# EAGLE design BR-Master-v1.1 (EAGLE 4.13)
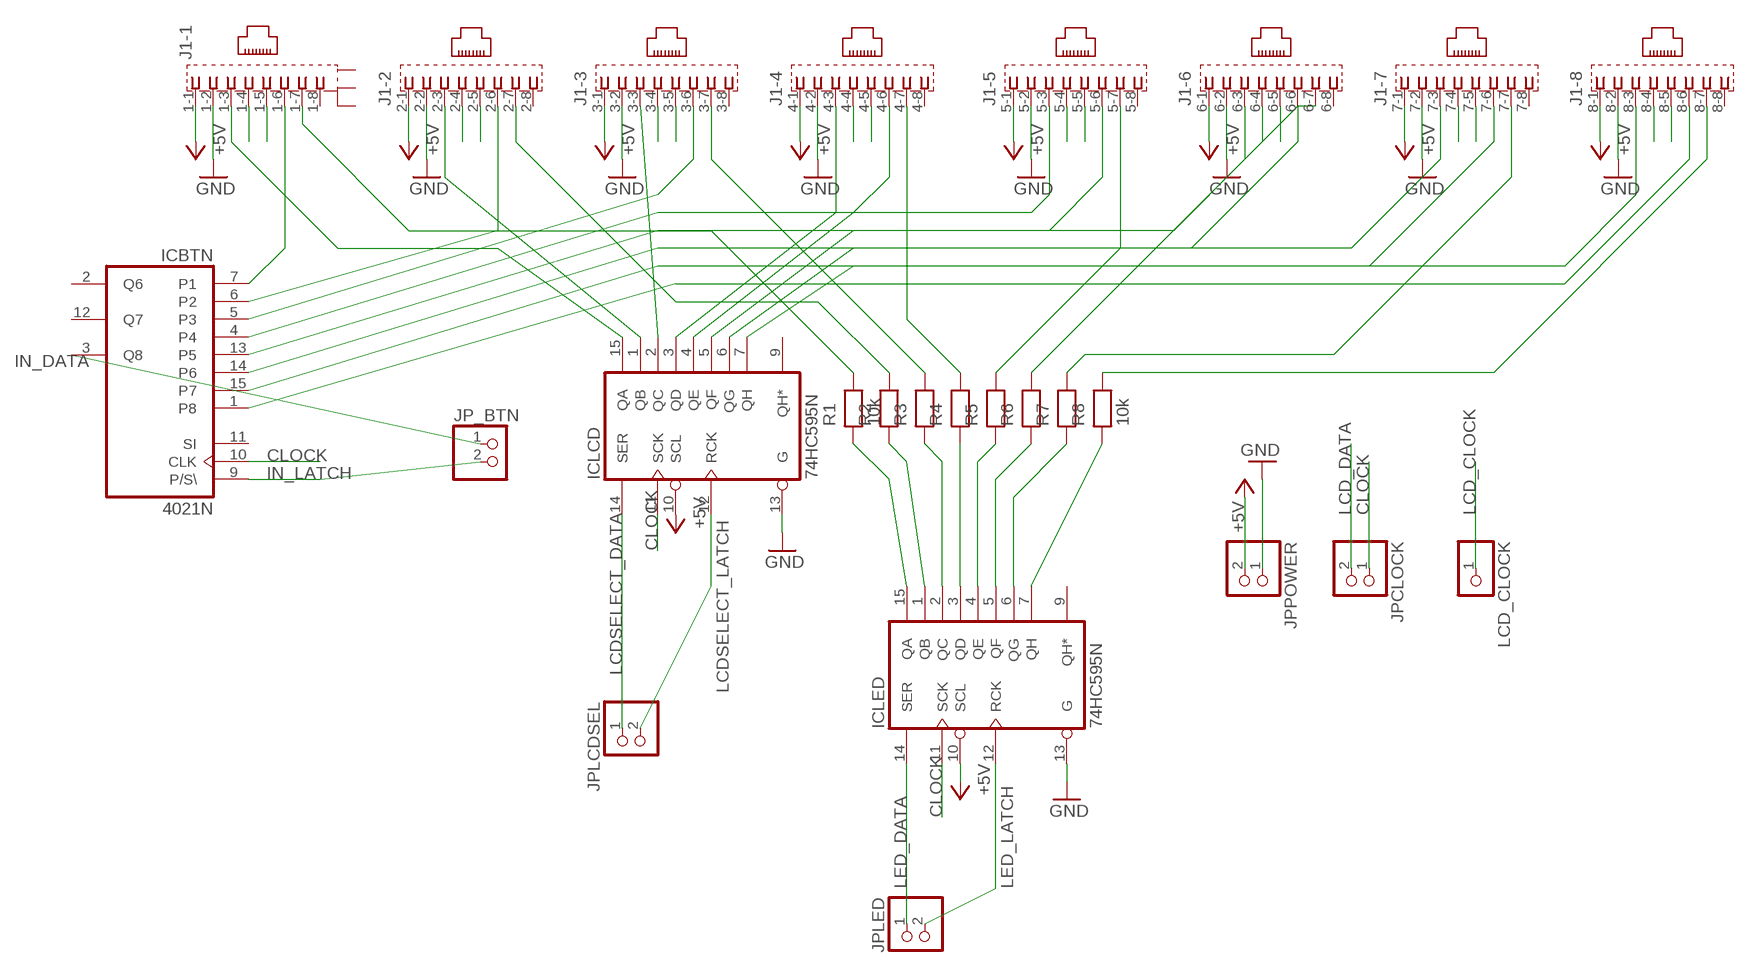
[diagram p0: schematic, sheet 1]

## Parts
ICBTN  4021N  [DIL16]
ICLCD  74HC595N  [DIL16]
ICLED  74HC595N  [DIL16]
J1  557573-1  [557573-1]
JP_BTN  PINHD-1X2  [1X02]
JPCLOCK  PINHD-1X2  [1X02]
JPLCDSEL  PINHD-1X2  [1X02]
JPLED  PINHD-1X2  [1X02]
JPPOWER  PINHD-1X2  [1X02]
LCD_CLOCK  PINHD-1X1  [1X01]
R1  10k  RESEU-12,5  [R-12,5]
R2  RESEU-12,5  [R-12,5]
R3  RESEU-12,5  [R-12,5]
R4  RESEU-12,5  [R-12,5]
R5  RESEU-12,5  [R-12,5]
R6  RESEU-12,5  [R-12,5]
R7  RESEU-12,5  [R-12,5]
R8  10k  RESEU-12,5  [R-12,5]

## Nets
BTN1: ICBTN.7(P1) J1.1-6
BTN2: ICBTN.6(P2) J1.2-6
BTN3: ICBTN.5(P3) J1.3-6
BTN4: ICBTN.4 J1.4-6
BTN5: ICBTN.13(P5) J1.5-6
BTN6: ICBTN.14(P6) J1.6-6
BTN7: ICBTN.15(P7) J1.7-6
BTN8: ICBTN.1(P8) J1.8-6
CLOCK: ICBTN.10(CLK) ICLCD.11(SCK) ICLED.11(SCK) JPCLOCK.1
IN_DATA: ICBTN.3(Q8) JP_BTN.1
IN_LATCH: ICBTN.9(P/S\) JP_BTN.2
LCD_CLOCK: J1.1-5 J1.2-5 J1.3-5 J1.4-5 J1.5-5 J1.6-5 J1.7-5 J1.8-5 LCD_CLOCK.1
LCD_DATA: J1.1-4 J1.2-4 J1.3-4 J1.4-4 J1.5-4 J1.6-4 J1.7-4 J1.8-4 JPCLOCK.2
LCDSELECT_DATA: ICLCD.14(SER) JPLCDSEL.1
LCDSELECT_LATCH: ICLCD.12(RCK) JPLCDSEL.2
LED_DATA: ICLED.14(SER) JPLED.1
LED_LATCH: ICLED.12(RCK) JPLED.2
N$1: ICLCD.15(QA) J1.1-3
N$2: ICLCD.1(QB) J1.2-3
N$3: ICLCD.2(QC) J1.3-3
N$4: ICLCD.3(QD) J1.4-3
N$5: ICLCD.4(QE) J1.5-3
N$6: ICLCD.5(QF) J1.6-3
N$7: ICLCD.6(QG) J1.7-3
N$8: ICLCD.7(QH) J1.8-3
N$9: ICLED.15(QA) R1.1
N$10: ICLED.1(QB) R2.1
N$11: ICLED.2(QC) R3.1
N$12: ICLED.3(QD) R4.1
N$13: ICLED.4(QE) R5.1
N$14: ICLED.5(QF) R6.1
N$15: ICLED.6(QG) R7.1
N$16: ICLED.7(QH) R8.1
N$17: J1.1-7 R1.2
N$18: J1.2-7 R2.2
N$19: J1.3-7 R3.2
N$20: J1.4-7 R4.2
N$21: J1.5-7 R5.2
N$22: J1.6-7 R6.2
N$23: J1.7-7 R7.2
N$24: J1.8-7 R8.2
VDD: ICLCD.10(SCL) ICLED.10(SCL) J1.1-1 J1.2-1 J1.3-1 J1.4-1 J1.5-1 J1.6-1 J1.7-1 J1.8-1 JPPOWER.2 ; supply symbol labelled +5V
VSS: ICLCD.13(G) ICLED.13(G) J1.1-2 J1.2-2 J1.3-2 J1.4-2 J1.5-2 J1.6-2 J1.7-2 J1.8-2 JPPOWER.1 ; supply symbol labelled GND
Unconnected: ICBTN.2(Q6) ICBTN.11(SI) ICBTN.12(Q7) ICLCD.9(QH*) ICLED.9(QH*) J1.1-8 J1.2-8 J1.3-8 J1.4-8 J1.5-8 J1.6-8 J1.7-8 J1.8-8 J1.G1 J1.G2 J1.G3

## Power pins joined to a net without a drawn wire
VDD: ICBTN.16(VDD) ICLCD.16(VCC) ICLED.16(VCC)
VSS: ICBTN.8(VSS) ICLCD.8(GND) ICLED.8(GND)

## Library data of the parts
ICBTN = 40xx:4021: 8-bit static SHIFT REGISTER
ICLCD ICLED = 74xx-eu:74*595: 8-bit SHIFT REGISTER, output latch
J1 = con-amp:557573-1: AMP connector
JP_BTN JPCLOCK JPLCDSEL JPLED JPPOWER = pinhead:PINHD-1X2: PIN HEADER
LCD_CLOCK = pinhead:PINHD-1X1: PIN HEADER
R1-R8 = discrete:RESEU-12,5

## Board
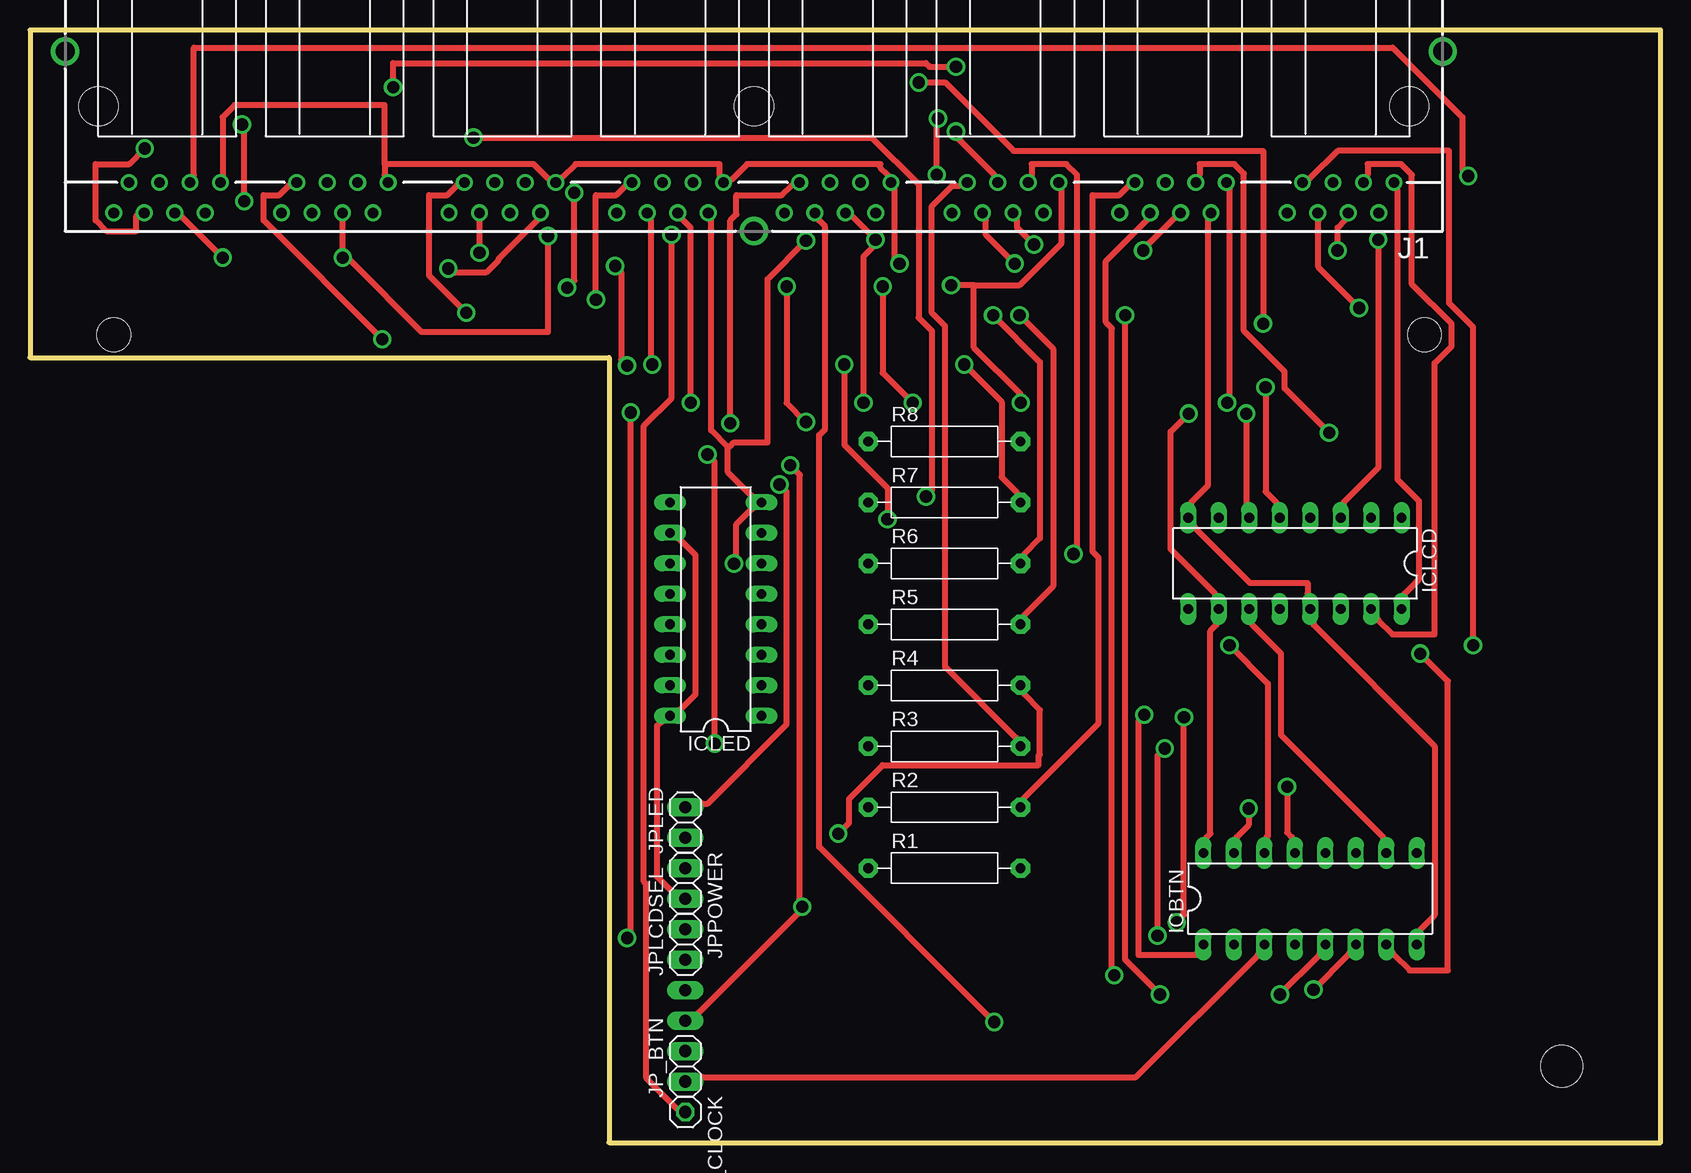
[diagram p1: board, top side]
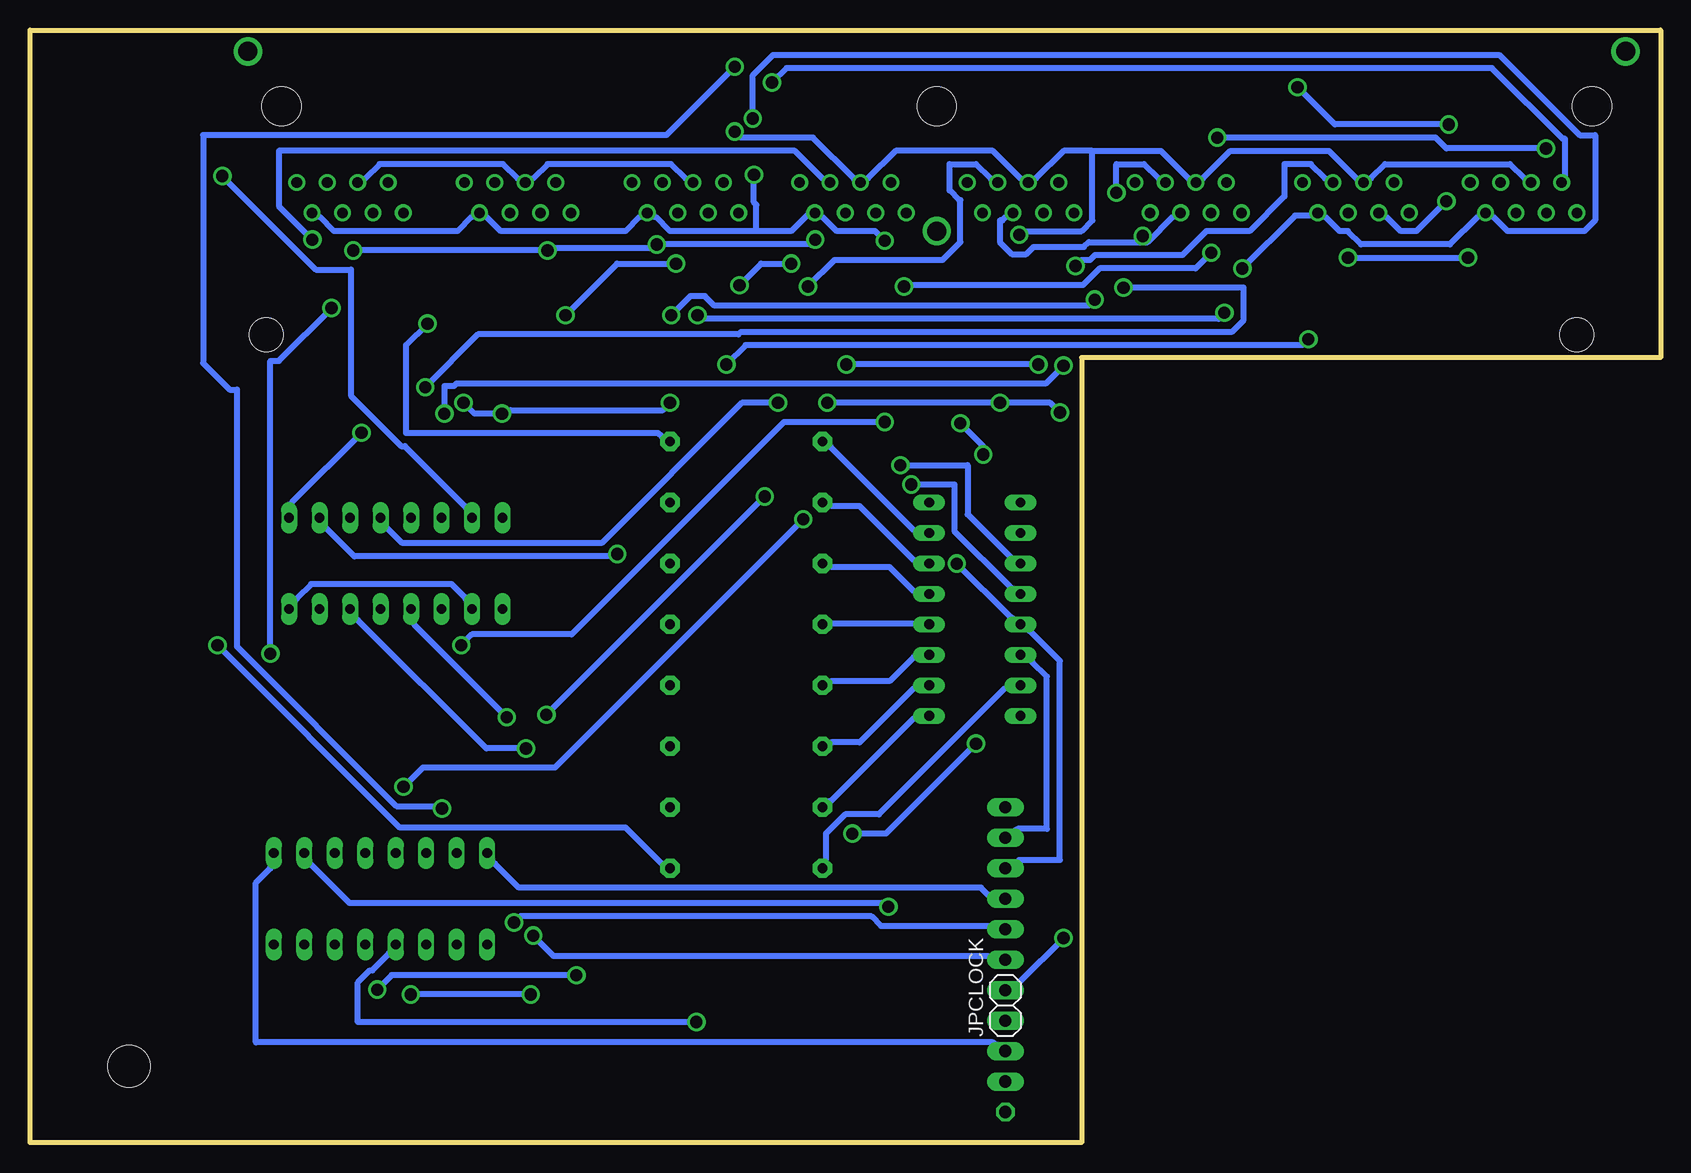
[diagram p2: board, bottom side, seen from below]

Size 135.89 x 92.71 mm. Coordinates in mm from the lower left corner, seen from the top.
Outline: 0,92.71 0,65.41 48.26,65.41 48.26,0 135.89,0 135.89,92.71 0,92.71
Copper layers (1*16): Top 0.035mm / dielectric 1.5mm / Bottom 0.035mm
Design rules "default": minimum track width 20mil, minimum drill 40mil, track to track 20mil, track to pad 20mil, pad to pad 8mil, via to via 8mil, smd to smd 8mil, copper to edge 20mil, drill to drill 8mil, minimum pad ring 10mil, minimum via ring 8mil, stop-mask expansion 4mil, vias tented up to drill 0mil, thermal gap 10mil
Holes 2.8 mm at 116.2,67.31 6.99,67.31
Holes 3.5 mm at 127.64,6.35

### Footprints (pad centres in the part's own frame; a part is rotated, then mirrored left to right if it is on the bottom)
DIL16 = drill 0.813 long: 1 -8.89,-3.81; 2 -6.35,-3.81; 3 -3.81,-3.81; 4 -1.27,-3.81; 5 1.27,-3.81; 6 3.81,-3.81; 7 6.35,-3.81; 8 8.89,-3.81; 9 8.89,3.81; 10 6.35,3.81; 11 3.81,3.81; 12 1.27,3.81; 13 -1.27,3.81; 14 -3.81,3.81; 15 -6.35,3.81; 16 -8.89,3.81
557573-1 = drill 0.889 round: 1-1 -53.34,6.35; 1-2 -52.07,8.89; 1-3 -50.8,6.35; 1-4 -49.53,8.89; 1-5 -48.26,6.35; 1-6 -46.99,8.89; 1-7 -45.72,6.35; 1-8 -44.45,8.89; 2-1 -39.37,6.35; 2-2 -38.1,8.89; 2-3 -36.83,6.35; 2-4 -35.56,8.89; 2-5 -34.29,6.35; 2-6 -33.02,8.89; 2-7 -31.75,6.35; 2-8 -30.48,8.89; 3-1 -25.4,6.35; 3-2 -24.13,8.89; 3-3 -22.86,6.35; 3-4 -21.59,8.89; 3-5 -20.32,6.35; 3-6 -19.05,8.89; 3-7 -17.78,6.35; 3-8 -16.51,8.89; 4-1 -11.43,6.35; 4-2 -10.16,8.89; 4-3 -8.89,6.35; 4-4 -7.62,8.89; 4-5 -6.35,6.35; 4-6 -5.08,8.89; 4-7 -3.81,6.35; 4-8 -2.54,8.89; 5-1 2.54,6.35; 5-2 3.81,8.89; 5-3 5.08,6.35; 5-4 6.35,8.89; 5-5 7.62,6.35; 5-6 8.89,8.89; 5-7 10.16,6.35; 5-8 11.43,8.89; 6-1 16.51,6.35; 6-2 17.78,8.89; 6-3 19.05,6.35; 6-4 20.32,8.89; 6-5 21.59,6.35; 6-6 22.86,8.89; 6-7 24.13,6.35; 6-8 25.4,8.89; 7-1 30.48,6.35; 7-2 31.75,8.89; 7-3 33.02,6.35; 7-4 34.29,8.89; 7-5 35.56,6.35; 7-6 36.83,8.89; 7-7 38.1,6.35; 7-8 39.37,8.89; 8-1 44.45,6.35; 8-2 45.72,8.89; 8-3 46.99,6.35; 8-4 48.26,8.89; 8-5 49.53,6.35; 8-6 50.8,8.89; 8-7 52.07,6.35; 8-8 53.34,8.89 | drill 1.575 pad 2.184 round: G1 -57.404,-4.572; G2 0,10.414; G3 57.404,-4.572 | hole 3.251: -54.61,0; 54.61,0; 0,0
1X02 = drill 1.016 long: 1 -1.27,0; 2 1.27,0
1X01 = drill 1.016 octagon: 1 0,0
R-12,5 = drill 0.813 pad 1.6 octagon: 1 -6.35,0; 2 6.35,0

### Placement (x,y rotation side)
ICBTN  106.68,20.32 0 top
ICLCD  105.41,48.26 180 top
ICLED  57.15,44.45 90 top
J1  60.33,86.36 180 top
JP_BTN  54.61,6.35 90 top
JPCLOCK  54.61,11.43 90 bottom
JPLCDSEL  54.61,16.51 90 top
JPLED  54.61,26.67 90 top
JPPOWER  54.61,21.59 270 top
LCD_CLOCK  54.61,2.54 270 top
R1  76.2,22.86 0 top
R2  76.2,27.94 0 top
R3  76.2,33.02 0 top
R4  76.2,38.1 0 top
R5  76.2,43.18 0 top
R6  76.2,48.26 0 top
R7  76.2,53.34 0 top
R8  76.2,58.42 0 top

### Tracks (layer width: path | path; a pad name or v marks a point on that pad's centre or on a via)
BTN1  (via drill 1.02)
  Top 0.508: v115.86,40.74 118.16,38.44 118.16,14.34 114.96,14.34 113.66,15.64 ICBTN.7 | v110.76,69.54 107.36,72.94 107.36,76.84 J1.1-6
  Bottom 0.508: v115.86,40.74 115.86,65.14 115.16,65.14 v110.76,69.54
BTN2  (via drill 1.02)
  Top 0.508: v106.96,12.74 109.86,15.64 ICBTN.6 | v90.36,13.94 90.16,14.14 90.16,67.84 89.66,68.34 89.66,73.44 93.06,76.84 J1.2-6
  Bottom 0.508: v106.96,12.74 105.76,13.94 v90.36,13.94
BTN3  (via drill 1.02)
  Top 0.508: v104.16,12.34 107.36,15.54 ICBTN.5 | v94.16,12.34 91.26,15.24 v91.26,68.94 | v82.06,73.24 79.66,75.64 79.66,76.84 J1.3-6
  Bottom 0.508: v94.16,12.34 v104.16,12.34 | v91.26,68.94 86.96,73.24 v82.06,73.24
BTN4  (via drill 1.02)
  Top 0.508: v80.36,10.04 65.76,24.64 65.76,58.94 66.26,59.44 66.26,76.34 65.76,76.84 J1.4-6
  Bottom 0.508: v80.36,10.04 108.56,10.04 108.56,13.34 107.56,14.34 107.36,14.34 106.06,15.64 ICBTN.4
BTN5  (via drill 1.02)
  Top 0.508: v104.76,29.64 104.76,25.84 105.16,25.44 ICBTN.13 | v71.46,51.94 71.46,54.54 67.86,58.14 v67.86,64.84 | v51.86,64.84 51.76,64.94 51.76,76.84 J1.5-6
  Bottom 0.508: v104.76,29.64 103.16,31.24 92.16,31.24 v71.46,51.94 | v51.86,64.84 v67.86,64.84
BTN6  (via drill 1.02)
  Top 0.508: v99.96,41.44 103.16,38.24 103.16,25.54 103.06,25.44 ICBTN.14 | v64.66,60.04 63.06,61.64 v63.06,71.34 | v37.46,74.14 37.46,76.84 J1.6-6
  Bottom 0.508: v99.96,41.44 99.06,42.34 90.76,42.34 73.06,60.04 v64.66,60.04 | v63.06,71.34 62.96,71.44 48.16,71.44 46.76,72.84 38.76,72.84 v37.46,74.14
BTN7  (via drill 1.02)
  Top 0.508: v101.56,27.84 101.56,26.44 100.56,25.44 ICBTN.15 | v77.16,89.64 74.96,89.64 74.66,89.94 30.26,89.94 v30.26,87.94 | v17.66,84.84 17.86,84.64 v17.86,78.44
  Bottom 0.508: v101.56,27.84 101.76,28.04 105.36,28.04 118.66,41.34 118.66,62.74 119.26,62.74 121.46,64.94 121.46,83.94 82.86,83.94 v77.16,89.64 | v30.26,87.94 27.16,84.84 v17.66,84.84 | v17.86,78.44 20.36,75.94 21.66,75.94 22.86,77.14 J1.7-6
BTN8  (via drill 1.02)
  Top 0.508: v92.86,35.64 92.36,35.14 92.36,15.64 97.16,15.64 ICBTN.1 | v74.66,53.84 75.16,54.34 75.16,67.64 74.06,68.74 74.06,79.84 70.16,83.74 v36.96,83.74 | v9.56,82.84 8.26,81.54 5.46,81.54 5.46,76.84 6.36,75.94 8.86,75.94 8.86,77.24 J1.8-6
  Bottom 0.508: v74.66,53.84 v92.86,35.64 | v36.96,83.74 18.76,83.74 17.86,82.84 v9.56,82.84
CLOCK  (via drill 1.02)
  Top 0.508: ICBTN.10 112.76,25.44 104.26,33.94 104.26,40.74 101.86,43.14 ICLCD.11 | v63.36,56.44 64.16,55.64 64.16,19.64 | 64.16,19.64 64.16,19.24 55.76,10.84 JPCLOCK.1 | 64.16,19.64 v64.36,19.64
  Bottom 0.508: v63.36,56.44 57.76,56.44 57.76,52.34 54.26,48.84 ICLED.11 | v64.36,19.64 64.66,19.94 109.26,19.94 112.46,23.14 ICBTN.10
IN_DATA
  Top 0.508: ICBTN.3 102.26,15.54 92.16,5.44 56.06,5.44 JP_BTN.1
IN_LATCH
  Bottom 0.508: ICBTN.9 115.86,22.84 117.06,21.64 117.06,8.34 55.66,8.34 JP_BTN.2
LCD_CLOCK  (via drill 1.02)
  Top 0.508: v53.46,75.64 53.46,62.04 51.16,59.74 51.16,21.74 51.36,21.54 51.36,5.34 53.86,2.84 LCD_CLOCK.1 | v77.16,84.24 77.16,83.84 80.36,80.64 J1.3-5
  Bottom 0.508: J1.3-5 81.26,80.34 82.46,81.54 92.76,81.54 93.96,80.34 J1.2-5 95.26,80.34 96.46,81.54 106.76,81.54 107.96,80.34 J1.1-5 | J1.8-5 11.36,80.34 12.56,81.54 22.96,81.54 24.16,80.34 J1.7-5 25.36,80.34 27.66,82.64 35.86,82.64 38.16,80.34 J1.6-5 39.36,80.34 41.66,82.64 47.36,82.64 | 47.36,82.64 49.76,82.64 52.06,80.34 J1.5-5 53.36,80.34 55.66,82.64 63.76,82.64 66.06,80.34 J1.4-5 67.26,80.34 70.66,83.74 76.66,83.74 v77.16,84.24 | v53.46,75.64 53.16,75.94 48.26,75.94 47.36,76.84 47.36,82.64
LCD_DATA  (via drill 1.02)
  Top 0.508: v83.66,74.84 82.26,76.24 82.26,76.84 J1.3-4 | J1.4-4 68.56,77.14 v70.46,75.24 70.16,74.54 69.46,73.84 v69.46,61.64 | v92.76,74.34 92.76,74.44 95.36,77.04 J1.2-4 | v108.96,74.34 108.96,76.24 109.56,76.84 J1.1-4 | v16.06,73.74 12.66,77.14 J1.8-4 | J1.7-4 26.06,76.84 v26.06,73.74 26.76,73.44 32.66,67.54 43.16,67.54 v43.16,75.54 | v49.76,17.04 50.06,17.34 v50.06,60.84 | v55.06,61.64 55.06,76.24 54.36,76.94 J1.5-4
  Bottom 0.508: v70.46,75.24 70.86,74.84 v83.66,74.84 84.36,74.54 92.56,74.54 v92.76,74.34 v108.96,74.34 | v26.06,73.74 v16.06,73.74 | 43.16,75.04 47.66,75.04 48.06,74.64 52.26,74.64 52.86,74.04 54.06,74.04 55.06,75.04 55.06,76.84 54.86,76.84 54.56,77.14 J1.5-4 | 43.16,75.04 42.76,75.04 40.66,77.14 J1.6-4 | v49.76,17.04 53.46,13.34 JPCLOCK.2 | v50.06,60.84 50.86,61.64 v55.06,61.64 v69.46,61.64 | 43.16,75.04 v43.16,75.54
LCDSELECT_DATA  (via drill 1.02)
  Top 0.508: v94.56,32.84 93.96,32.24 v93.96,17.24
  Bottom 0.508: v94.56,32.84 97.86,32.84 108.56,43.54 ICLCD.14 | v93.96,17.24 92.26,15.54 56.06,15.54 JPLCDSEL.1
LCDSELECT_LATCH  (via drill 1.02)
  Top 0.508: v96.16,35.44 96.16,18.94 v95.56,18.34
  Bottom 0.508: v96.16,35.44 103.86,43.14 ICLCD.12 | v95.56,18.34 95.06,18.84 65.76,18.84 64.96,18.04 56.06,18.04 JPLCDSEL.2
LED_DATA
  Bottom 0.508: ICLED.14 52.36,40.04 51.16,38.84 51.16,26.14 53.56,26.14 JPLED.1
LED_LATCH  (via drill 1.02)
  Top 0.508: v62.46,54.84 63.06,54.24 63.06,34.84 56.46,28.24 56.06,28.24 JPLED.2
  Bottom 0.508: v62.46,54.84 58.86,54.84 58.86,50.94 54.26,46.34 ICLED.12
N$1
  Top 0.508: ICLCD.15 112.36,43.54 113.56,42.34 117.06,42.34 117.06,64.94 118.46,66.34 118.46,68.24 115.16,71.54 115.16,80.64 114.26,81.54 111.46,81.54 111.46,80.64 J1.1-3
N$2  (via drill 1.02)
  Top 0.508: v108.26,59.14 104.56,62.84 104.56,64.24 101.16,67.64 101.16,80.74 100.36,81.54 97.46,81.54 97.46,80.64 J1.2-3
  Bottom 0.508: v108.26,59.14 114.06,53.34 ICLCD.1
N$3  (via drill 1.02)
  Top 0.508: v86.96,49.04 87.26,49.34 87.26,80.64 86.36,81.54 83.46,81.54 83.46,80.64 J1.3-3
  Bottom 0.508: v86.96,49.04 87.16,48.84 108.86,48.84 111.16,51.14 ICLCD.2
N$4  (via drill 1.02)
  Top 0.508: v112.36,75.24 112.36,56.24 109.46,53.34 ICLCD.3
  Bottom 0.508: v112.36,75.24 115.16,78.04 115.16,82.64 72.16,82.64 69.86,80.34 J1.4-3
N$5  (via drill 1.02)
  Top 0.508: v73.56,61.64 71.06,64.14 v71.06,71.34
  Bottom 0.508: v73.56,61.64 76.56,61.64 88.26,49.94 104.86,49.94 106.06,51.14 ICLCD.4 | v71.06,71.34 68.86,73.54 59.86,73.54 58.36,75.04 58.36,78.54 58.46,78.54 59.26,79.34 59.26,81.54 57.06,81.54 55.86,80.34 J1.5-3
N$6  (via drill 1.02)
  Top 0.508: v102.96,62.94 102.96,54.24 103.86,53.34 ICLCD.5 | v44.76,71.24 45.36,71.84 v45.36,79.14
  Bottom 0.508: v102.96,62.94 98.56,67.34 76.86,67.34 76.66,67.54 35.76,67.54 34.76,68.54 34.76,71.24 v44.76,71.24 | v45.36,79.14 45.36,81.54 43.06,81.54 41.86,80.34 J1.6-3
N$7  (via drill 1.02)
  Top 0.508: v101.36,60.74 101.36,53.34 ICLCD.6 | v49.76,64.74 49.26,65.24 49.26,72.54 v48.76,73.04
  Bottom 0.508: v101.36,60.74 101.36,63.04 100.56,63.04 100.36,63.24 51.26,63.24 v49.76,64.74 | v48.76,73.04 48.26,73.54 47.56,73.54 47.16,73.94 39.86,73.94 37.86,75.94 34.26,75.94 31.36,78.84 31.36,81.54 29.16,81.54 27.96,80.34 J1.7-3
N$8  (via drill 1.02)
  Top 0.508: v119.86,80.54 119.36,81.04 119.36,85.44 113.56,91.24 13.66,91.24 13.66,80.64 J1.8-3
  Bottom 0.508: v119.86,80.54 112.06,72.74 109.16,72.74 109.16,62.24 104.96,58.04 104.66,58.04 99.66,53.04 ICLCD.7
N$9
  Bottom 0.508: ICLED.15 54.66,37.84 65.16,27.34 67.96,27.34 69.56,25.74 69.56,23.64 R1.1
N$10
  Bottom 0.508: ICLED.1 62.26,35.34 69.16,28.44 69.26,28.44 R2.1
N$11
  Bottom 0.508: ICLED.2 62.26,37.84 66.76,33.34 69.06,33.34 R3.1
N$12
  Bottom 0.508: ICLED.3 62.26,40.44 64.26,38.44 69.06,38.44 R4.1
N$13
  Bottom 0.508: ICLED.4 62.26,43.24 69.06,43.24 R5.1
N$14
  Bottom 0.508: ICLED.5 62.26,45.94 64.26,47.94 69.06,47.94 R6.1
N$15
  Bottom 0.508: ICLED.6 62.26,48.54 66.76,53.04 69.06,53.04 R7.1
N$16
  Bottom 0.508: ICLED.7 62.26,51.04 69.16,57.94 69.26,57.94 R8.1
N$17  (via drill 1.02)
  Top 0.508: v120.26,41.44 120.26,67.94 118.26,69.94 118.26,82.64 108.96,82.64 106.66,80.34 J1.1-7
  Bottom 0.508: v120.26,41.44 105.06,26.24 86.26,26.24 83.26,23.24 R1.2
N$18
  Top 0.508: J1.2-7 91.46,79.64 90.76,78.94 88.56,78.94 88.56,49.24 89.06,48.74 89.06,34.94 82.86,28.74 R2.2
N$19
  Top 0.508: J1.3-7 77.46,79.74 76.86,79.74 75.16,78.04 75.16,69.14 76.26,68.04 76.26,39.64 82.16,33.74 R3.2
N$20  (via drill 1.02)
  Top 0.508: v58.36,59.94 58.36,76.84 58.86,77.34 58.86,78.94 62.66,78.94 63.46,79.74 J1.4-7 | v56.46,57.34 57.06,56.74 v57.06,33.24 | v67.36,25.74 68.26,26.64 68.26,28.64 71.06,31.44 84.06,31.44 84.06,32.24 84.16,32.34 84.16,36.04 82.86,37.34 R4.2
  Bottom 0.508: v58.36,59.94 56.46,58.04 v56.46,57.34 | v57.06,33.24 64.56,25.74 v67.36,25.74
N$21  (via drill 1.02)
  Top 0.508: v47.16,70.24 47.16,78.94 48.86,78.94 49.56,79.64 J1.5-7 | v82.46,68.94 85.26,66.14 85.26,46.34 82.86,43.94 R5.2
  Bottom 0.508: v47.16,70.24 47.66,69.74 78.86,69.74 79.66,70.54 80.86,70.54 v82.46,68.94
N$22  (via drill 1.02)
  Top 0.508: v36.36,69.14 33.26,72.24 33.26,78.94 34.76,78.94 35.56,79.74 J1.6-7 | v80.26,68.94 84.16,65.04 84.16,50.34 82.86,49.04 R6.2
  Bottom 0.508: v36.36,69.14 36.86,68.64 79.96,68.64 v80.26,68.94
N$23  (via drill 1.02)
  Top 0.508: v29.36,66.94 19.46,76.84 19.46,78.94 20.76,78.94 21.56,79.74 J1.7-7 | v77.86,64.84 80.96,61.74 80.96,55.44 82.26,54.14 R7.2
  Bottom 0.508: v29.36,66.94 29.86,66.44 76.26,66.44 v77.86,64.84
N$24  (via drill 1.02)
  Top 0.508: v74.06,88.34 76.26,88.34 81.96,82.64 102.76,82.64 v102.76,68.24
  Bottom 0.508: v74.06,88.34 72.86,89.54 14.06,89.54 8.16,83.64 7.96,83.64 7.96,80.64 J1.8-7 | v102.76,68.24 104.56,66.44 104.56,59.14 83.56,59.14 83.26,58.84 R8.2
VDD  (via drill 1.02)
  Top 0.508: 29.56,81.54 29.56,80.64 J1.7-1 | 29.56,81.54 29.56,86.44 17.06,86.44 16.06,85.44 16.06,80.64 J1.8-1 | 29.56,81.54 41.96,81.54 43.16,80.34 J1.6-1 44.36,80.44 45.46,81.54 57.46,81.54 57.46,80.64 J1.5-1 58.46,80.24 59.76,81.54 70.86,81.54 70.86,81.24 71.46,80.64 J1.4-1 72.06,79.34 72.06,73.64 v72.46,73.24 | 78.66,71.44 v76.76,71.44 | 78.66,71.44 82.46,71.44 85.96,74.94 85.96,79.34 J1.3-1 | JPPOWER.2 53.46,20.94 52.26,22.14 52.26,34.74 52.46,34.94 ICLED.16 54.26,36.14 55.46,37.34 55.46,48.94 54.26,50.14 ICLED.10 | ICBTN.16 98.06,25.44 98.36,25.74 98.36,42.64 98.86,43.14 ICLCD.10 98.76,45.74 95.06,49.44 95.06,59.24 v96.56,60.74 | v99.76,61.64 99.96,61.84 99.96,79.34 J1.2-1 | J1.1-1 113.96,79.34 113.96,55.24 115.76,53.44 115.76,46.94 114.56,45.74 ICLCD.16 | v82.56,61.64 82.56,62.34 78.66,66.24 78.66,71.44
  Bottom 0.508: v76.76,71.44 74.96,73.24 v72.46,73.24 | ICLCD.16 113.66,45.34 112.46,46.54 100.76,46.54 99.66,45.44 ICLCD.10 | v99.76,61.64 98.86,60.74 v96.56,60.74 95.86,61.04 83.16,61.04 v82.56,61.64 | JPPOWER.2 56.06,20.64 56.66,21.24 95.16,21.24 97.16,23.24 ICBTN.16
VSS  (via drill 1.02)
  Top 0.508: 58.16,57.94 58.16,55.84 60.06,53.94 ICLED.8 60.06,52.74 58.86,51.54 58.86,48.44 v58.66,48.24 | 58.16,57.94 56.76,59.34 56.76,76.84 J1.5-2 | ICBTN.8 115.86,17.74 117.06,18.94 117.06,33.04 106.96,43.14 ICLCD.13 106.46,45.74 106.46,46.64 101.66,46.64 97.16,51.14 ICLCD.8 96.76,53.34 98.16,54.74 98.16,76.84 J1.2-2 | v34.86,72.84 34.86,72.54 38.06,72.54 39.06,73.54 39.06,73.64 42.26,76.84 J1.6-2 | v75.66,85.34 75.56,85.24 v75.56,80.64 | v64.66,75.14 61.46,71.94 61.46,58.34 58.66,58.34 58.36,58.04 58.16,57.94
  Bottom 0.508: JPPOWER.1 53.46,23.54 50.06,23.54 50.06,40.14 52.46,42.54 ICLED.13 54.26,43.84 v58.66,48.24 | v34.86,72.84 30.46,77.24 29.26,77.24 J1.7-2 27.96,77.14 26.76,75.94 26.06,75.94 24.96,74.84 17.56,74.84 15.26,77.14 J1.8-2 13.96,77.14 12.76,75.94 6.36,75.94 5.46,76.84 5.46,83.94 6.76,83.94 13.46,90.64 73.96,90.64 75.66,88.94 v75.66,85.34 | 75.36,75.94 82.56,75.94 83.76,77.14 83.86,77.14 J1.3-2 85.06,77.14 86.26,75.94 96.66,75.94 97.86,77.14 J1.2-2 99.06,77.14 100.26,75.94 110.56,75.94 111.76,77.14 J1.1-2 | 75.36,75.94 72.46,75.94 71.16,77.24 J1.4-2 69.86,77.14 68.66,75.94 65.46,75.94 v64.66,75.14 | v75.56,80.64 75.56,78.34 75.36,78.14 75.36,75.94